# EAGLE design xu1541 (EAGLE 4.16)
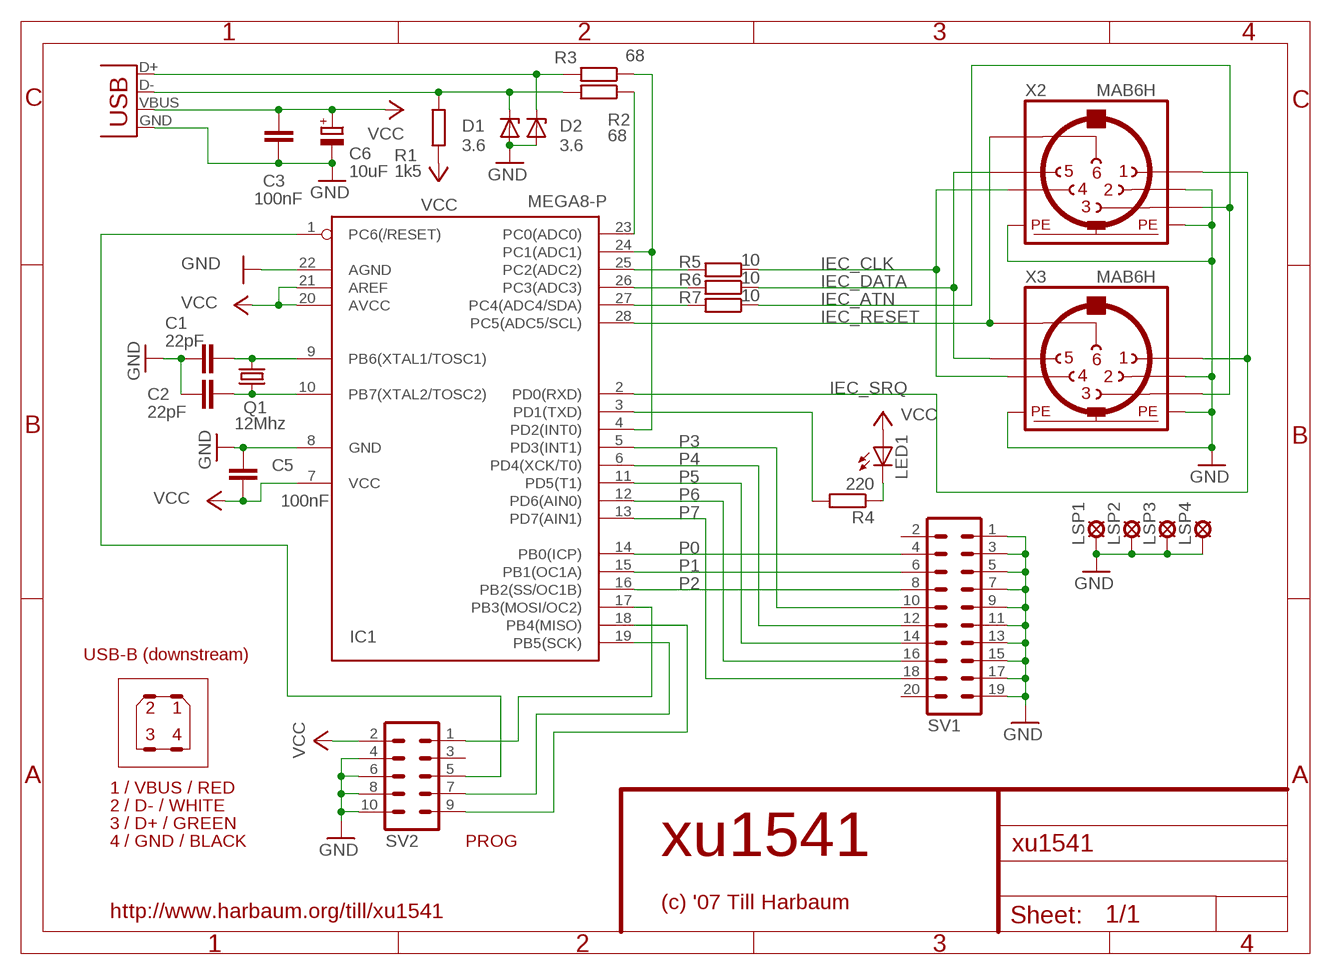
[diagram p0: schematic, sheet 1]

## Parts
C1  22pF  C-EU025-025X050  [C025-025X050]
C2  22pF  C-EU025-025X050  [C025-025X050]
C3  100nF  C-EU050-025X075  [C050-025X075]
C5  100nF  C-EU050-025X075  [C050-025X075]
C6  10uF  CPOL-EUTT2D5L  [TT2D5L]
D1  3.6  ZENER-DIODEDO35Z10  [DO35Z10]
D2  3.6  ZENER-DIODEDO35Z10  [DO35Z10]
IC1  MEGA8-P  [DIL28-3]
LED1  LED3MM  [LED3MM]
LSP1  LSP13  [LSP13]
LSP2  LSP13  [LSP13]
LSP3  LSP13  [LSP13]
LSP4  LSP13  [LSP13]
Q1  12Mhz  CRYTALHC49S  [HC49/S]
R1  1k5  R-EU_0207/10  [0207/10]
R2  68  R-EU_0207/10  [0207/10]
R3  68  R-EU_0207/10  [0207/10]
R4  220  R-EU_0207/10  [0207/10]
R5  10  R-EU_0207/10  [0207/10]
R6  10  R-EU_0207/10  [0207/10]
R7  10  R-EU_0207/10  [0207/10]
SV1  ML20  [ML20]
SV2  ML10  [ML10]
X1  USB-B-H  [USB-B-H]
X2  MAB6H  [MAB6H]
X3  MAB6H  [MAB6H]

## Nets
/LED: IC1.3(PD1(TXD)) R4.2
GND: C1.1 C2.1 C3.2 C5.1 C6.- D1.A D2.A IC1.8(GND) IC1.22(AGND) LSP1.MP LSP2.MP LSP3.MP LSP4.MP SV1.1 SV1.3 SV1.5 SV1.7 SV1.9 SV1.11 SV1.13 SV1.15 SV1.17 SV1.19 SV2.4 SV2.6 SV2.8 SV2.10 X1.GND X2.2 X2.PE X2.PE@(PE) X3.2 X3.PE X3.PE@(PE)
IEC_ATN: R7.1 X2.3 X3.3
IEC_CLK: R5.1 X2.4 X3.4
IEC_DATA: R6.1 X2.5 X3.5
IEC_RESET: IC1.28(PC5(ADC5/SCL)) X2.6 X3.6
IEC_SRQ: IC1.2(PD0(RXD)) X2.1 X3.1
N$1: C1.2 IC1.9(PB6(XTAL1/TOSC1)) Q1.2
N$2: C2.2 IC1.10(PB7(XTAL2/TOSC2)) Q1.1
N$3: IC1.25(PC2(ADC2)) R5.2
N$4: IC1.26(PC3(ADC3)) R6.2
N$5: D1.C R1.1 R2.2 X1.D-
N$6: D2.C R3.2 X1.D+
N$7: IC1.27(PC4(ADC4/SDA)) R7.2
N$8: IC1.23(PC0(ADC0)) R2.1
N$9: IC1.4(PD2(INT0)) IC1.24(PC1(ADC1)) R3.1
N$10: IC1.17(PB3(MOSI/OC2)) SV2.1
N$11: IC1.1(PC6(/RESET)) SV2.5
N$12: IC1.19(PB5(SCK)) SV2.7
N$13: IC1.18(PB4(MISO)) SV2.9
N$14: LED1.K(C) R4.1
P0: IC1.14(PB0(ICP)) SV1.4
P1: IC1.15(PB1(OC1A)) SV1.6
P2: IC1.16(PB2(SS/OC1B)) SV1.8
P3: IC1.5(PD3(INT1)) SV1.10
P4: IC1.6(PD4(XCK/T0)) SV1.12
P5: IC1.11(PD5(T1)) SV1.14
P6: IC1.12(PD6(AIN0)) SV1.16
P7: IC1.13(PD7(AIN1)) SV1.18
VCC: C3.1 C5.2 C6.+ IC1.7(VCC) IC1.20(AVCC) IC1.21(AREF) LED1.A R1.2 SV2.2 X1.VBUS
Unconnected: SV1.2 SV1.20 SV2.3

## Notes on the sheet
- USB-B (downstream)
- 2 | 1
- 3 | 4
- 1 / VBUS / RED
- 2 / D- / WHITE
- 3 / D+ / GREEN
- 4 / GND / BLACK | PROG
- xu1541
- (c) '07 Till Harbaum
- http://www.harbaum.org/till/xu1541

## Library data of the parts
C1-C3 C5 = rcl:C-EU: CAPACITOR, European symbol
C6 = rcl:CPOL-EU: POLARIZED CAPACITOR, European symbol
D1 D2 = diode:ZENER-DIODE: Z-Diode
IC1 = avr:MEGA8-P: MICROCONTROLLER 8 Kbytes FLASH 1 kbytes SRAM 512 bytes EEPROM USART 4-channel 10 bit ADC 2-channel 8 bit ADC
LED1 = led:LED: LED OSRAM: - CHIPLED LG R971, LG N971, LY N971, LG Q971, LY Q971, LO R971, LY R971 LH N974, LH R974 LS Q976, LO Q976, LY Q976 LO Q996 - Hyper CHIPLED LW Q18S LB Q993, LB Q99A, LB R99A - SideLED LS A670, LO A670, LY A670, LG A670, LP A670 LB A673, LV A673, LT A673, LW A673 LH A674 LY A675 LS A676, LA A676, LO A676, LY A676, LW A676 LS A679, LY A679, LG A679 - Hyper Micro SIDELED® LS Y876, LA Y876, LO Y876, LY Y876 LT Y87S - SmartLED LW L88C, LW L88S LB L89C, LB L89S, LG L890 LS L89K, LO L89K, LY L89K LS L896, LA L896, LO L896, LY L896 - TOPLED LS T670, LO T670, LY T670, LG T670, LP T670 LSG T670, LSP T670, LSY T670, LOP T670, LYG T670 LG T671, LOG T671, LSG T671 LB T673, LV T673, LT T673, LW T673 LH T674 LS T676, LA T676, LO T676, LY T676, LB T676, LH T676, LSB T676, LW T676 LB T67C, LV T67C, LT T67C, LS T67K, LO T67K, LY T67K, LW E67C LS E67B, LA E67B, LO E67B, LY E67B, LB E67C, LV E67C, LT E67C LW T67C LS T679, LY T679, LG T679 LS T770, LO T770, LY T770, LG T770, LP T770 LB T773, LV T773, LT T773, LW T773 LH T774 LS E675, LA E675, LY E675, LS T675 LS T776, LA T776, LO T776, LY T776, LB T776 LHGB T686 LT T68C, LB T68C - Hyper Mini TOPLED® LB M676 - Mini TOPLED Santana® LG M470 LS M47K, LO M47K, LY M47K Source: http://www.osram.convergy.de/
LSP1-LSP4 = solpad:LSP13: SOLDER PAD drill 1.3 mm, distributor Buerklin, 12H562
Q1 = crystal:CRYTAL: CRYSTAL
R1-R7 = rcl:R-EU_: RESISTOR, European symbol
SV1 = con-harting-ml:ML20: HARTING
SV2 = con-harting-ml:ML10: HARTING
X1 = con-usb:USB: USB Connectors
X2 X3 = con-hirschmann:MAB6H: Female CONNECTOR 6 pins with shield, horizontal (DIN 45322)

## Board
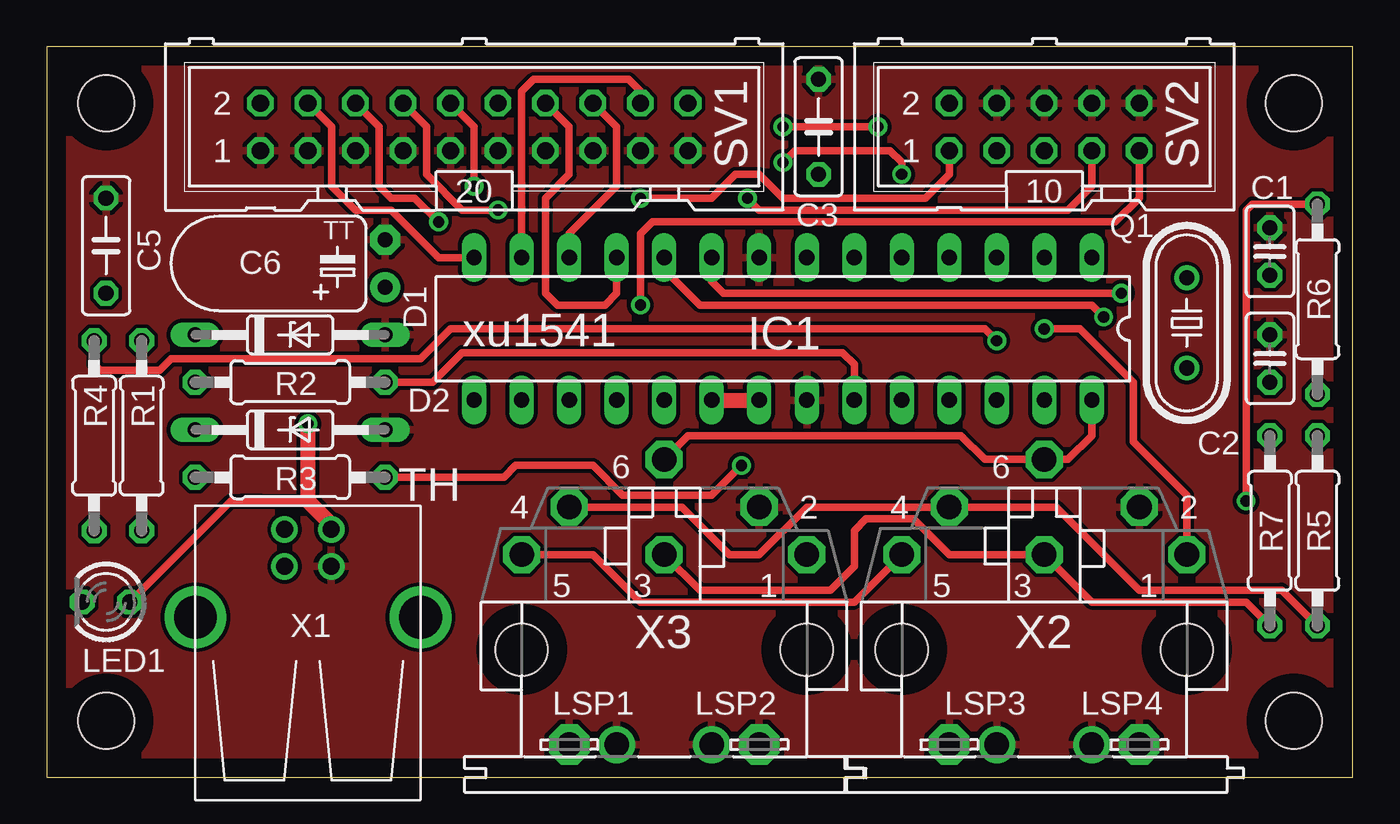
[diagram p1: board, top side]
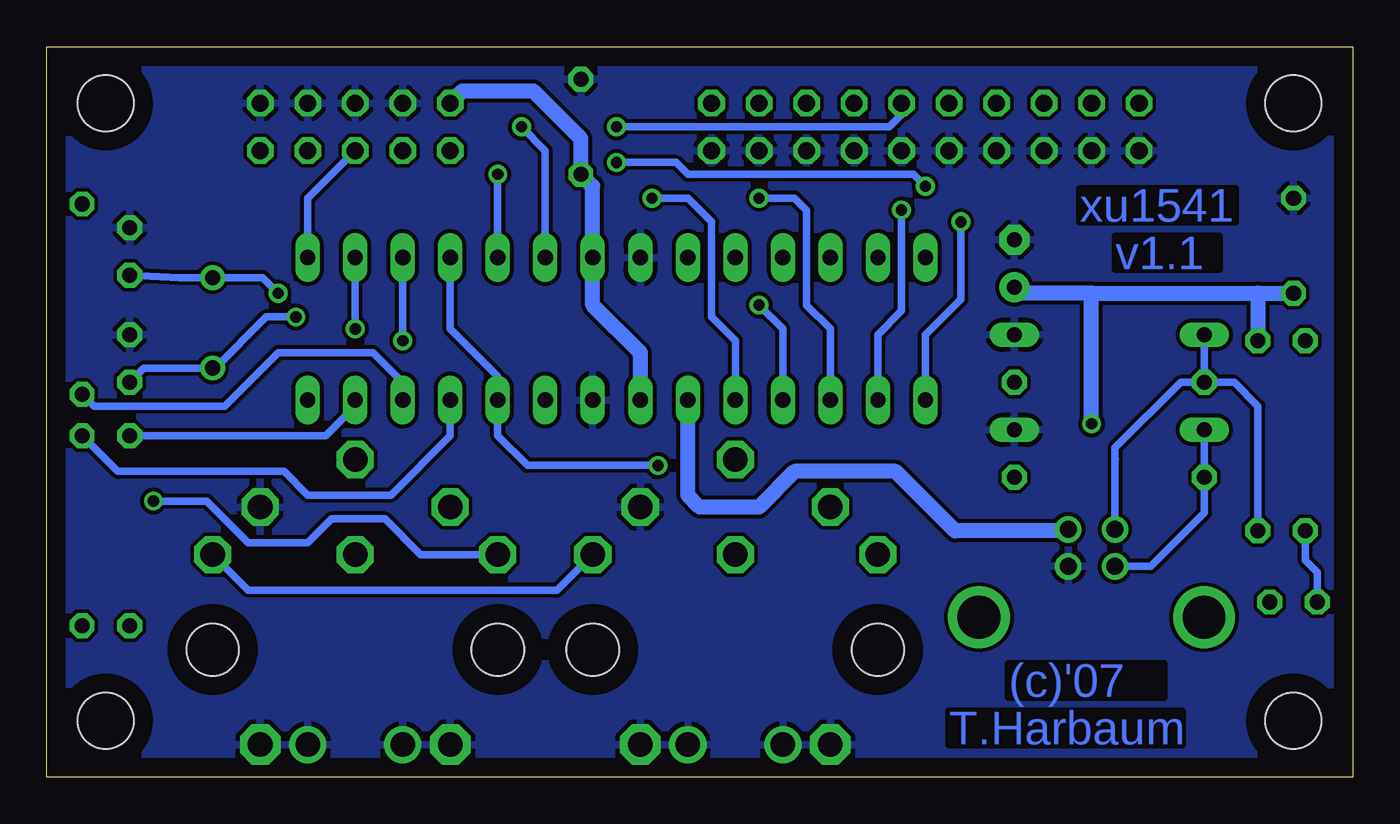
[diagram p2: board, bottom side, seen from below]

Size 69.83 x 39.04 mm. Coordinates in mm from the lower left corner, seen from the top.
Outline: 0,0 69.83,0 69.83,39.04 0,39.04 0,0
Copper layers (1*16): Top 0.035mm / dielectric 1.5mm / Bottom 0.035mm
Design rules "default": minimum track width 10mil, minimum drill 24mil, track to track 8mil, track to pad 8mil, pad to pad 8mil, via to via 8mil, smd to smd 8mil, copper to edge 40mil, drill to drill 8mil, minimum pad ring 10mil, minimum via ring 8mil, stop-mask expansion 4mil, vias tented up to drill 0mil, thermal gap 10mil
Holes 3 mm at 3.17,3.01 3.17,36.03 66.67,36.03 66.67,3.01

### Footprints (pad centres in the part's own frame; a part is rotated, then mirrored left to right if it is on the bottom)
C025-025X050 = drill 0.813 octagon: 1 -1.27,0; 2 1.27,0
C050-025X075 = drill 0.813 octagon: 1 -2.54,0; 2 2.54,0
TT2D5L = drill 0.813 pad 1.6 round: + -1.27,0 | drill 0.813 pad 1.6 octagon: - 1.27,0
DO35Z10 = drill 0.813 long: A 5.08,0; C -5.08,0
DIL28-3 = drill 0.813 long: 1 -16.51,-3.81; 2 -13.97,-3.81; 3 -11.43,-3.81; 4 -8.89,-3.81; 5 -6.35,-3.81; 6 -3.81,-3.81; 7 -1.27,-3.81; 8 1.27,-3.81; 9 3.81,-3.81; 10 6.35,-3.81; 11 8.89,-3.81; 12 11.43,-3.81; 13 13.97,-3.81; 14 16.51,-3.81; 15 16.51,3.81; 16 13.97,3.81; 17 11.43,3.81; 18 8.89,3.81; 19 6.35,3.81; 20 3.81,3.81; 21 1.27,3.81; 22 -1.27,3.81; 23 -3.81,3.81; 24 -6.35,3.81; 25 -8.89,3.81; 26 -11.43,3.81; 27 -13.97,3.81; 28 -16.51,3.81
LED3MM = drill 0.813 octagon: A -1.27,0; K 1.27,0
LSP13 = drill 1.321 pad 2.159 octagon: MP 0,0
HC49/S = drill 0.813 round: 1 -2.413,0; 2 2.413,0
0207/10 = drill 0.813 octagon: 1 -5.08,0; 2 5.08,0
ML20 = drill 0.914 octagon: 1 -11.43,-1.27; 2 -11.43,1.27; 3 -8.89,-1.27; 4 -8.89,1.27; 5 -6.35,-1.27; 6 -6.35,1.27; 7 -3.81,-1.27; 8 -3.81,1.27; 9 -1.27,-1.27; 10 -1.27,1.27; 11 1.27,-1.27; 12 1.27,1.27; 13 3.81,-1.27; 14 3.81,1.27; 15 6.35,-1.27; 16 6.35,1.27; 17 8.89,-1.27; 18 8.89,1.27; 19 11.43,-1.27; 20 11.43,1.27
ML10 = drill 0.914 octagon: 1 -5.08,-1.27; 2 -5.08,1.27; 3 -2.54,-1.27; 4 -2.54,1.27; 5 0,-1.27; 6 0,1.27; 7 2.54,-1.27; 8 2.54,1.27; 9 5.08,-1.27; 10 5.08,1.27
USB-B-H = drill 0.914 round: D+ 0,1.25; D- 1.981,1.25; GND 0,-1.25; VBUS 1.981,-1.25 | drill 2.286 round: P$1 -2.718,-6.02; P$2 -2.718,6.02
MAB6H = drill 1.321 octagon: 1 7.62,5.08; 2 5.08,7.62; 3 0,5.08; 4 -5.08,7.62; 5 -7.62,5.08; 6 0,10.16 | drill 1.321 round: PE -2.54,-5.08; PE@ 2.54,-5.08 | hole 2.794: 7.62,0; -7.62,0

### Placement (x,y rotation side)
C1  65.4,28.09 270 top
C2  65.4,22.38 270 top
C3  41.27,34.76 90 top
C5  3.17,28.41 270 top
C6  18.09,27.46 90 top
D1  13.01,23.65 0 top
D2  13.01,18.57 0 top
IC1  39.37,23.96 180 top
LED1  3.17,9.36 180 top
LSP1  27.93,1.74 0 top
LSP2  38.1,1.74 0 top
LSP3  48.26,1.74 0 top
LSP4  58.41,1.74 0 top
Q1  60.96,24.28 90 top
R1  5.08,18.25 90 top
R2  13.01,21.11 180 top
R3  13.01,16.03 180 top
R4  2.54,18.25 90 top
R5  67.94,13.17 90 top
R6  67.94,25.55 270 top
R7  65.4,13.17 90 top
SV1  22.86,34.76 0 top
SV2  53.34,34.76 0 top
X1  13.97,11.27 90 top
X2  53.34,6.82 0 top
X3  33.02,6.82 0 top

### Tracks (layer width: path | path; a pad name or v marks a point on that pad's centre or on a via)
/LED  (via drill 0.6)
  Top 0.406: R4.2 2.54,22.06 2.85,21.74 6.03,21.74 6.66,22.38 20,22.38 21.58,23.96 50.16,23.96 v50.8,23.33
  Bottom 0.406: v50.8,23.33 IC1.3
GND
  pour Bottom: -0.01,-0.17 -0.01,39.2 69.84,39.2 69.84,-0.17
  pour Top: -0.01,-0.17 -0.01,39.2 69.84,39.2 69.84,-0.17
IEC_ATN
  Top 0.406: X3.3 34.92,10 41.91,10 43.18,11.27 43.18,13.17 43.81,13.81 46.35,13.81 48.26,11.9 X2.3 55.88,9.36 64.13,9.36 R7.1
IEC_CLK
  Top 0.406: R5.1 66.03,10 58.41,10 53.97,14.44 X2.4 40.64,14.44 38.1,11.9 36.51,11.9 33.97,14.44 X3.4
IEC_DATA  (via drill 0.6)
  Top 0.406: X3.5 29.2,11.9 31.74,9.36 43.18,9.36 X2.5 | v64.13,14.76 64.13,30.31 64.45,30.63 R6.1
  Bottom 0.406: X2.5 49.84,11.9 51.75,13.81 54.61,13.81 55.88,12.54 59.05,12.54 61.27,14.76 v64.13,14.76
IEC_RESET
  Top 0.406: X3.6 34.29,18.25 48.89,18.25 50.16,16.98 X2.6 54.61,16.98 55.88,18.25 IC1.28
IEC_SRQ  (via drill 0.61)
  Top 0.406: v53.34,23.96 55.24,23.96 58.1,21.11 58.1,17.93 60.96,15.08 X2.1
  Bottom 0.406: X3.1 42.54,10 59.05,10 X2.1 | v53.34,23.96 IC1.2
N$1  (via drill 0.6)
  Top 0.406: IC1.9 35.55,26.5 36.19,25.87 v57.46,25.87
  Bottom 0.406: C1.2 62.73,26.7 Q1.2 58.29,26.7 v57.46,25.87
N$2  (via drill 0.6)
  Top 0.406: IC1.10 33.02,27.14 34.92,25.23 55.88,25.23 v56.51,24.6
  Bottom 0.406: C2.2 64.64,21.87 Q1.1 60.83,21.87 58.1,24.6 v56.51,24.6
N$3
  Bottom 0.406: IC1.25 48.26,18.25 51.43,15.08 55.88,15.08 57.15,16.34 66.03,16.34 R5.2
N$4
  Bottom 0.406: IC1.26 50.8,21.11 52.38,22.7 57.46,22.7 60.32,19.84 67.3,19.84 R6.2
N$5
  Bottom 0.406: R2.2 D1.C | 12.72,16.98 X1.D- | 12.72,16.98 12.72,17.59 9.2,21.11 R2.2 | 12.72,16.98 12.7,16.98 | R1.1 5.08,19.84 6.34,21.11 R2.2
N$6
  Bottom 0.406: D2.C R3.2 7.93,14.12 10.79,11.27 X1.D+
N$7
  Bottom 0.406: IC1.27 53.34,19.84 54.92,18.25 R7.2
N$8
  Top 0.406: R2.1 20.63,21.11 22.22,22.7 42.54,22.7 43.18,22.06 IC1.23
N$9  (via drill 0.6)
  Top 0.406: v37.14,16.66 35.55,15.08 30.79,15.08 29.2,16.66 25.08,16.66 24.44,16.03 R3.1
  Bottom 0.406: IC1.4 48.26,23.96 45.72,21.42 IC1.24 45.72,18.25 44.13,16.66 v37.14,16.66
N$10  (via drill 0.6)
  Top 0.406: v31.74,30.95 35.55,30.95 36.83,32.22 38.1,32.22 39.37,30.95 46.98,30.95 48.26,32.22 SV2.1
  Bottom 0.406: IC1.17 27.93,23.96 29.2,25.23 29.2,30.31 29.84,30.95 v31.74,30.95
N$11
  Bottom 0.406: IC1.1 55.88,30.95 SV2.5
N$12  (via drill 0.6)
  Top 0.406: SV2.7 55.88,31.58 54.61,30.31 38.1,30.31 v37.46,30.95
  Bottom 0.406: IC1.19 33.02,23.33 34.29,24.6 34.29,29.68 35.55,30.95 v37.46,30.95
N$13  (via drill 0.6)
  Top 0.406: SV2.9 58.41,30.95 57.15,29.68 32.38,29.68 31.74,29.04 v31.74,25.23
  Bottom 0.406: IC1.18 30.47,23.96 v31.74,25.23
N$14
  Bottom 0.406: LED1.K 1.9,10.95 2.54,11.58 R4.1
P0
  Top 0.406: IC1.14 20.95,27.77 18.41,30.31 16.5,30.31 15.24,31.58 15.24,34.76 SV1.4
P1  (via drill 0.6)
  Top 0.406: SV1.6 17.77,34.76 17.77,31.58 18.41,30.95 19.68,30.95 v20.95,29.68
  Bottom 0.406: v20.95,29.68 20.95,25.55 22.86,23.65 IC1.15
P2  (via drill 0.6)
  Top 0.406: SV1.8 20.31,34.76 20.31,32.22 22.22,30.31 v24.12,30.31
  Bottom 0.406: v24.12,30.31 24.12,24.92 25.39,23.65 IC1.16
P3  (via drill 0.6)
  Top 0.406: SV1.10 22.86,34.76 v22.86,31.58 | v39.37,32.85 40,33.49 45.08,33.49 45.72,32.85 v45.72,32.22
  Bottom 0.406: v45.72,32.22 IC1.5 | v22.86,31.58 23.49,32.22 35.55,32.22 36.19,32.85 v39.37,32.85
P4  (via drill 0.6)
  Top 0.406: v39.37,34.76 v44.45,34.76
  Bottom 0.406: SV1.12 24.12,35.39 24.76,34.76 v39.37,34.76 | IC1.6 43.18,33.49 v44.45,34.76
P5
  Top 0.406: IC1.11 30.47,25.87 29.84,25.23 27.3,25.23 26.66,25.87 26.66,30.95 27.93,32.22 27.93,34.76 SV1.14
P6
  Top 0.406: IC1.12 27.93,29.04 30.47,31.58 30.47,34.76 SV1.16
P7
  Top 0.406: IC1.13 25.39,36.66 26.03,37.3 31.11,37.3 31.74,36.66 SV1.18
VCC  (via drill 0.6)
  Top 0.406: LED1.A 9.84,14.76 11.43,14.76 | 11.43,14.76 10.47,14.76 | 11.43,14.76 13.97,14.76
  Top 0.813: v13.97,18.88 13.97,14.76 15.22,13.51 | IC1.20 IC1.21 | 15.22,13.51 15.24,13.17 | 15.22,13.51 X1.VBUS
  Bottom 0.813: 13.97,25.87 5.08,25.87 | 5.08,25.87 C5.2 | 13.97,25.87 17.77,25.87 C6.+ | SV2.2 47.62,36.66 43.81,36.66 41.27,34.12 C3.1 40.64,31.58 IC1.7 40.64,25.23 38.1,22.7 IC1.21 | v13.97,18.88 13.97,25.87 | IC1.20 35.55,15.08 34.92,14.44 31.74,14.44 29.84,16.34 24.44,16.34 21.27,13.17 15.24,13.17 15.24,13.27 X1.VBUS | 5.08,25.87 R1.2

### Text on the board
Bottom: xu1541 | v1.1 | (c)'07 | T.Harbaum
tNames: xu1541 | TH